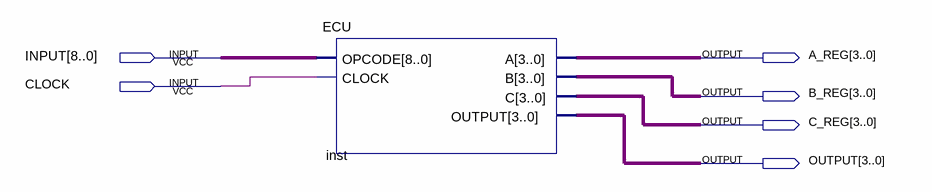
[diagram p0: schematic sheet]
// Quartus schematic ECU9.bdf as structural Verilog: 1 symbols, 6 pins
module ECU9 (
  input  [8:0] INPUT,
  input  CLOCK,
  output [3:0] A_REG,
  output [3:0] B_REG,
  output [3:0] C_REG,
  output [3:0] OUTPUT
);

  ECU inst (.OPCODE(INPUT), .CLOCK(CLOCK), .A(A_REG), .B(B_REG), .C(C_REG), .OUTPUT(OUTPUT));
endmodule
